# EasyEDA Pro project ProPrj_flap_controller_v2_2024-11-15.epro

# Schematic Flap_controller_r1

## Sheets
1 PSU: Board Name: Board1; Create Date: 2024-10-24; Page Name: PSU; Project Name: flap_controller_v2; Schematic Name: Flap_controller_r1; Update Date: 2024-10-27; Company: EasyEDA.com; Drawn: EasyEDA; Page Size: A4; Part Number: JLCPCB-002; Reviewed: EasyEDA; Version: V0.1
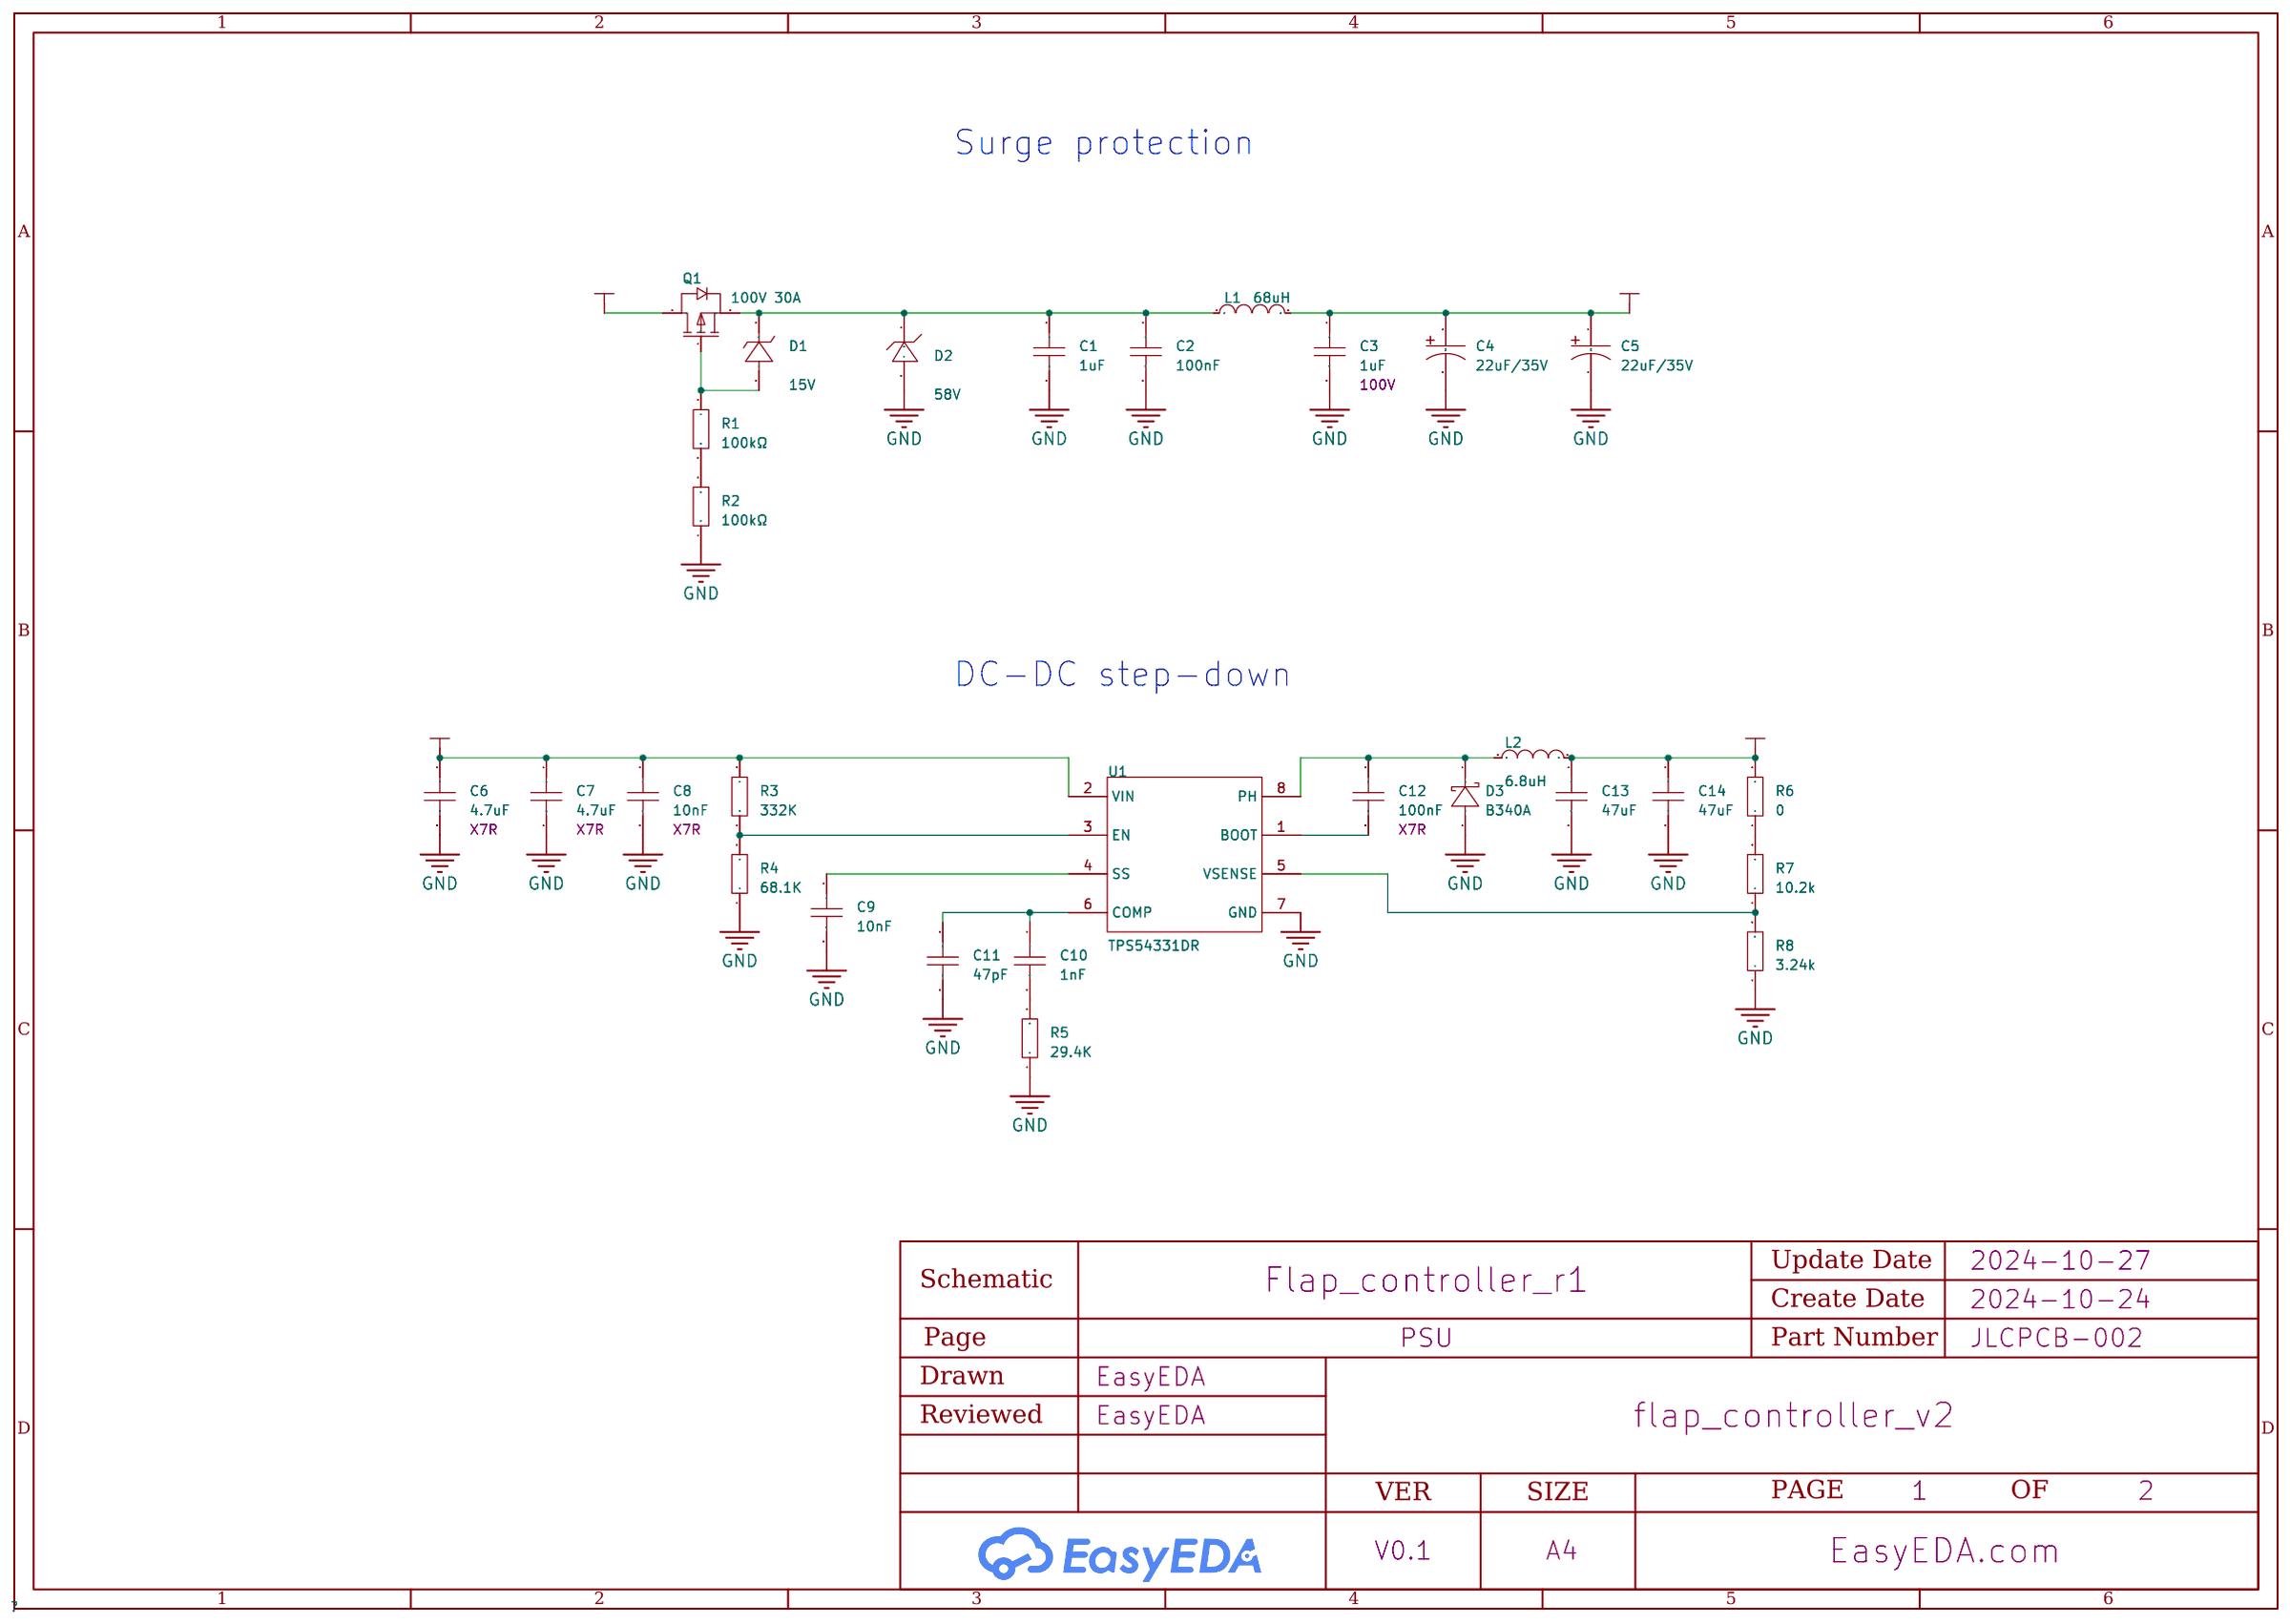
[diagram p0: PSU]
2 MCU: Create Date: 2024-10-25; Page Name: MCU; Update Date: 2024-10-30
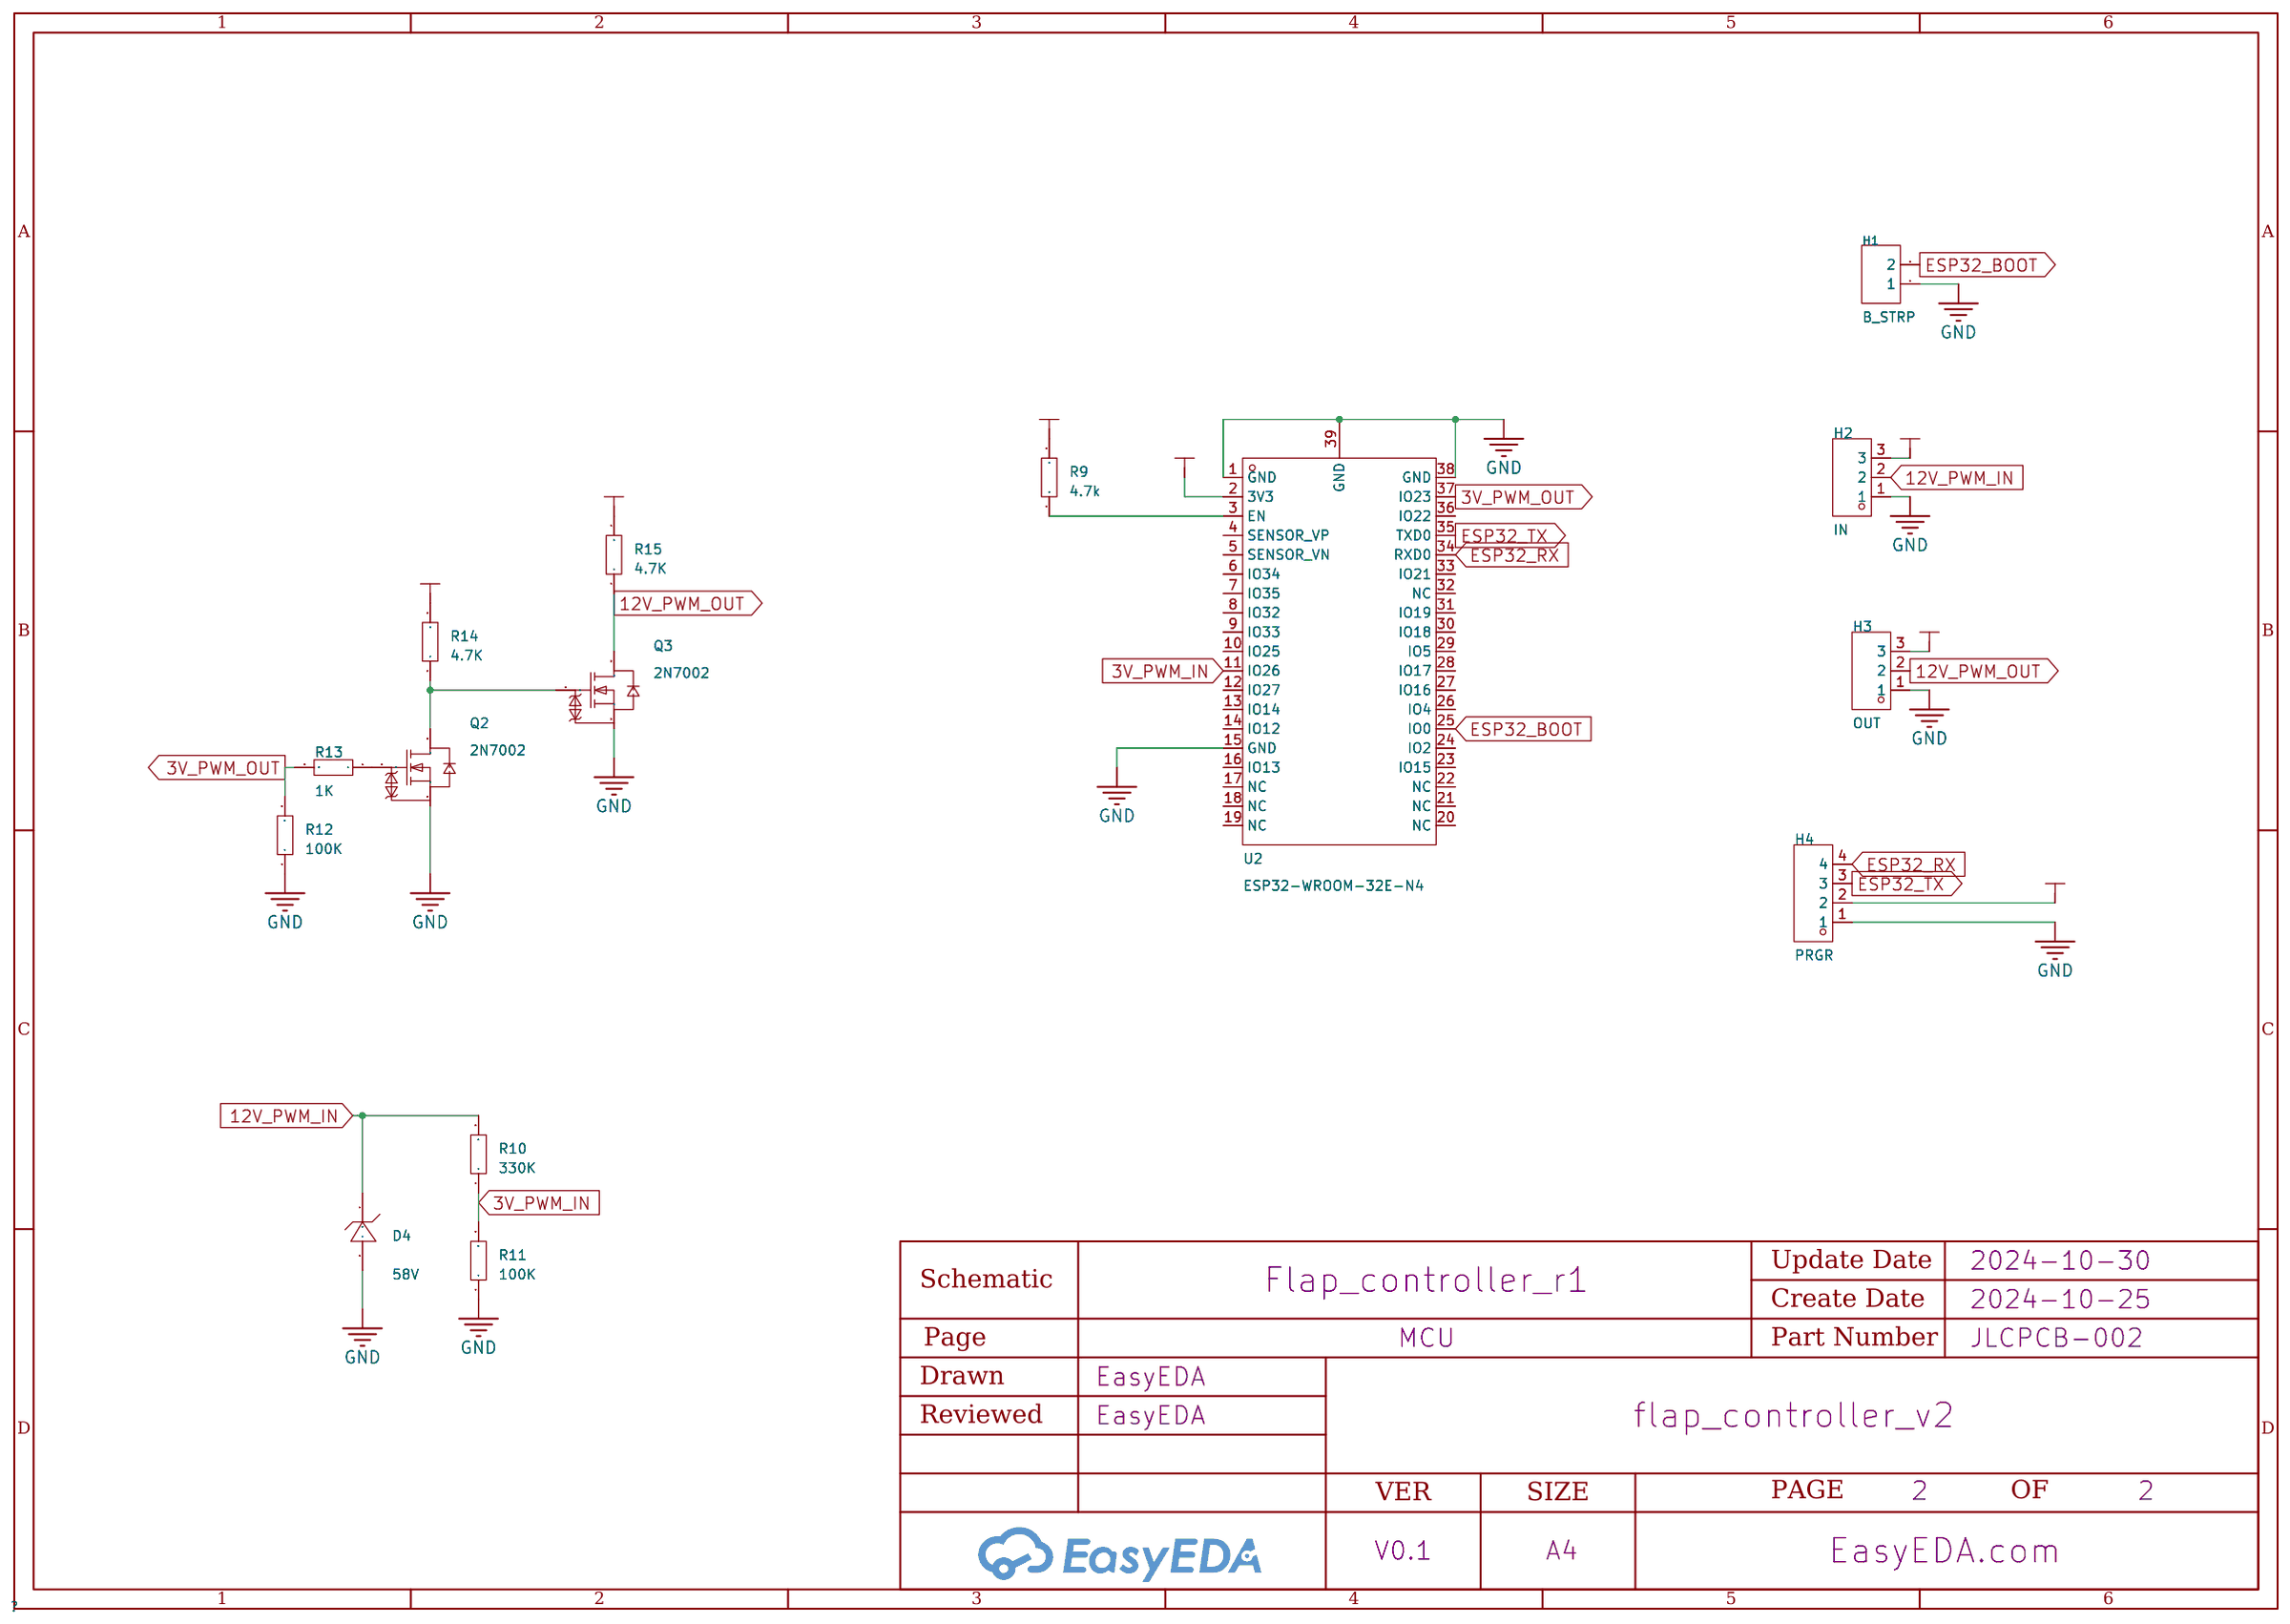
[diagram p1: MCU]

## Parts
sheet MCU
D4  58V  [SMB_L4.6-W3.6-LS5.3-RD]
H1  B_STRP  [HDR-TH_2P-P1.27-V-F-1]
H2  IN  [HDR-TH_3P-P2.54-V-F_MF254V-11-03-0743]
H3  OUT  [HDR-TH_3P-P2.54-V-F_MF254V-11-03-0743]
H4  PRGR  [HDR-TH_4P-P1.27-V-M-R2-C2-S1.27-2]
Q2  2N7002  [SOT-23-3_L2.9-W1.3-P0.95-LS2.4-BR]
Q3  2N7002  [SOT-23-3_L2.9-W1.3-P0.95-LS2.4-BR]
R9  4.7k  [R0603]
R10  330K  [R0603]
R11  100K  [R0603]
R12  100K  [R0603]
R13  1K  [R0603]
R14  4.7K  [R0603]
R15  4.7K  [R0603]
U2  ESP32-WROOM-32E-N4  [WIFI-SMD_ESP32-WROOM-32E]
sheet PSU
C1  1uF  [C0603]
C2  100nF  [C0603]
C3  1uF  [C0603]
C4  22uF/35V  [CAP-D5.0-F2.0]
C5  22uF/35V  [CAP-D5.0-F2.0]
C6  4.7uF  [C0603]
C7  4.7uF  [C0603]
C8  10nF  [C0603]
C9  10nF  [C0603]
C10  1nF  [C0603]
C11  47pF  [C0603]
C12  100nF  [C0603]
C13  47uF  [C0603]
C14  47uF  [C0603]
D1  15V  [SOD-323_L1.7-W1.3-LS2.5-RD]
D2  58V  [SMB_L4.6-W3.6-LS5.3-RD]
D3  B340A  [SMA_L4.3-W2.6-LS5.0-RD]
L1  68uH  [IND-SMD_L5.8-W5.2]
L2  6.8uH  [IND-SMD_L5.8-W5.2]
Q1  100V 30A  [TO-252-2_L6.6-W6.1-P4.57-LS10.1-BL]
R1  100kΩ  [R0603]
R2  100kΩ  [R0603]
R3  332K  [R0603]
R4  68.1K  [R0603]
R5  29.4K  [R0603]
R6  0  [R0603]
R7  10.2k  [R0603]
R8  3.24k  [R0603]
U1  TPS54331DR  [SOIC-8_L5.0-W4.0-P1.27-LS6.0-BL]

## Library data of the parts
D2 D4 = DO-214AA: Supplier Part: C9900011828; JLCPCB Part Class: Extended Part; Supplier: LCSC
H1 = B-2100S02P-A110: Pin Structure:1x2P Pitch:2.54mm Row Spacing:- Circluar Pins/Square Pins:- Mounting Type:Straight Number of Rows:Plugin Number of Pins:2P Current Rating (Max):- Voltage Rating (Max):- Length of Mating Pin:6mm Insulation Height:2.54mm Length of End Connecti; LCSC Part Name: 间距:2.54mm 1x2P 直插; Supplier Part: C124375; Manufacturer: Ckmtw(灿科盟); Supplier Footprint: 插件,P=2.54mm; JLCPCB Part Class: Extended Part; Datasheet: https://atta.szlcsc.com/upload/public/pdf/source/20221019/2EE72DAC61CAA62C0A53546E211F9C15.pdf; Supplier: LCSC; Pin Structure: 1x2P; Pitch: 2.54mm; Mounting Type: Straight; Number of Rows: Plugin; Number of Pins: 2P; Length of Mating Pin: 6mm; Insulation Height: 2.54mm; Length of End Connection Pin: 3mm; Operating Temperature Range: -40℃~+105℃; Color: Black
H2 H3 = 3pin插件排针: Supplier Part: C9900022322; Supplier Footprint: HDR-TH-3P; JLCPCB Part Class: Extended Part; Supplier: LCSC
H4 = HDR2.54-LI-2x4P: Supplier Part: C9900020145; Supplier Footprint: HDR-TH_4P-P2.54-V-M; JLCPCB Part Class: Extended Part; Supplier: LCSC
Q2 Q3 = 2N7002_C2926143: Type:1个NChannel Drain Source Voltage (Vdss): Continuous Drain Current (Id): Power Dissipation (Pd): Drain Source On Resistance (RDS(on)@Vgs,Id):7.5Ω@10V,500mA Gate Threshold Voltage (Vgs(th)@Id):2.5V@250uA Total Gate Charge (Qg@Vgs):- Input Capacitance (C; LCSC Part Name: 1个N沟道 耐压:60V 电流:115mA; Supplier Part: C2926143; Manufacturer: FOSAN(富信); Supplier Footprint: SOT-23; JLCPCB Part Class: Extended Part; Datasheet: https://atta.szlcsc.com/upload/public/pdf/source/20211203/ADA58B55D21332913BB6AE5F95CD54D7.pdf; Supplier: LCSC; Type: 1个NChannel; Drain Source On Resistance (RDS(on)@Vgs,Id): 7.5Ω@10V,500mA; Gate Threshold Voltage (Vgs(th)@Id): 2.5V@250uA; Input Capacitance (Ciss@Vds): 50pF@25V; Operating Temperature: -55℃~+150℃@(Tj)
R3-R15 = Res_0603: Supplier Footprint: 0603
U2 = ESP32-WROOM-32E-N4: LCSC Part Name: 通用型Wi-Fi+BT+BLE MCU模组; Supplier Part: C701341; Manufacturer: ESPRESSIF(乐鑫); Supplier Footprint: SMD,18x25.5mm; JLCPCB Part Class: Extended Part; Datasheet: https://atta.szlcsc.com/upload/public/pdf/source/20220601/0020821B65DE5740BBACA5FACC5CF3B6.pdf; Supplier: LCSC
C1 = C0603X105K025T: Capacitance: Tolerance:±10% Tolerance:±10% Voltage Rated: Temperature Coefficient:; LCSC Part Name: 1uF ±10% 25V; Supplier Part: C559292; Manufacturer: IHHEC(禾伸堂); Supplier Footprint: 0603; JLCPCB Part Class: Extended Part; Datasheet: https://atta.szlcsc.com/upload/public/pdf/source/20181218/C172721_07ABA3A1C2D7E9B9870089BDC15ED9B1.pdf; Supplier: LCSC; Tolerance: ±10%
C2 = C0603X104K050T: Capacitance: Tolerance:±10% Tolerance:±10% Voltage Rated: Temperature Coefficient:; LCSC Part Name: 100nF ±10% 50V; Supplier Part: C187860; Manufacturer: IHHEC(禾伸堂); Supplier Footprint: 0603; JLCPCB Part Class: Extended Part; Datasheet: https://atta.szlcsc.com/upload/public/pdf/source/20180316/B1A881EE882D7AA2911761F448C7BFE2.pdf; Supplier: LCSC; Tolerance: ±10%
C3 = CAP_0603: Supplier Footprint: 1206; Voltage: 100V
C4 C5 = 22uF/35V: Supplier Part: C9900004917; Supplier Footprint: CAP-SMD_BD5.0-L5.3-W5.3-LS6.0; JLCPCB Part Class: Extended Part; Supplier: LCSC
C6 C7 C12 = CAP_0603: X7R; Supplier Footprint: 0603
C8 = CAP_0603: Supplier Footprint: X7R
C9-C11 C13 C14 = CAP_0603: Supplier Footprint: 0603
D1 = SOD-323_C9900016724: LCSC Part Name: SOD-323; Supplier Part: C9900016724; Manufacturer Part: SOD-323; Supplier Footprint: SMD-2P; JLCPCB Part Class: Extended Part; Supplier: LCSC
D3 = B340A_C3018525: Forward Voltage (Vf@If):550mV@3A Reverse Voltage (Vr):40V Average Rectified Current (Io):3A Reverse Leakage Current (Ir):500uA@40V; LCSC Part Name: 电压:40V 电流:3A; Supplier Part: C3018525; Manufacturer: FUXINSEMI(富芯森美); Supplier Footprint: SMA(DO-214AC); JLCPCB Part Class: Extended Part; Datasheet: https://atta.szlcsc.com/upload/public/pdf/source/20220530/48889337C27311960E6F9D350CFD44EF.pdf; Supplier: LCSC; Forward Voltage (Vf@If): 550mV@3A; Reverse Voltage (Vr): 40V; Average Rectified Current (Io): 3A; Reverse Leakage Current (Ir): 500uA@40V
L1 = CY54-68UH: Inductance: Tolerance:±10% Tolerance:±10% Rated Current: Saturation Current (Isat):- DC Resistance (DCR): Q @ Freq:- Frequency - Self Resonant:- Ratings:; LCSC Part Name: 68uH ±10%; Supplier Part: C2929435; Manufacturer: SHOU HAN(首韩); Supplier Footprint: SMD,5.8x5.2mm; JLCPCB Part Class: Extended Part; Datasheet: https://atta.szlcsc.com/upload/public/pdf/source/20211213/2CA85409B3B1311983E9E122C3568FF5.pdf; Supplier: LCSC; Tolerance: ±10%
L2 = CY43-6.8UH: Inductance: Tolerance:±20% Tolerance:±20% Rated Current: Saturation Current (Isat):- DC Resistance (DCR): Q @ Freq:- Frequency - Self Resonant:- Ratings:; LCSC Part Name: 6.8uH ±20%; Supplier Part: C2929418; Manufacturer: SHOU HAN(首韩); Supplier Footprint: SMD,4.5x4mm; JLCPCB Part Class: Extended Part; Datasheet: https://atta.szlcsc.com/upload/public/pdf/source/20211213/F55B86B0868B9AEBF7E59DA1CDBCEB7E.pdf; Supplier: LCSC; Tolerance: ±20%
Q1 = AP30P10D: Type:1个PChannel Drain Source Voltage (Vdss): Continuous Drain Current (Id): Power Dissipation (Pd): Drain Source On Resistance (RDS(on)@Vgs,Id):78mΩ@10V,10A Gate Threshold Voltage (Vgs(th)@Id):1.7V@250uA Total Gate Charge (Qg@Vgs):44.5nC@10V Input Capacit; LCSC Part Name: 1个P沟道 耐压:100V 电流:30A; Supplier Part: C3011470; Manufacturer: APM(永源微电子); Supplier Footprint: TO-252-3L; JLCPCB Part Class: Extended Part; Datasheet: https://atta.szlcsc.com/upload/public/pdf/source/20220507/245812471C0427AA2FCAA6F221AD1110.pdf; Supplier: LCSC; Type: 1个PChannel; Drain Source On Resistance (RDS(on)@Vgs,Id): 78mΩ@10V,10A; Gate Threshold Voltage (Vgs(th)@Id): 1.7V@250uA; Total Gate Charge (Qg@Vgs): 44.5nC@10V; Input Capacitance (Ciss@Vds): 3.029nF@20V; Reverse Transfer Capacitance (Crss@Vds): 76pF@20V; Operating Temperature: -55℃~+150℃@(Tj)
R1 R2 = SCR0603F100K: Type:Thick Film Resistors Resistance: Tolerance:±1% Tolerance:±1% Power(Watts): Overload Voltage (Max): Operating Temperature Range:-55℃~+155℃ Operating Temperature Range:-55℃~+155℃; LCSC Part Name: 厚膜电阻 100kΩ ±1% 100mW; Supplier Part: C3016388; Manufacturer: VO(翔胜); Supplier Footprint: 0603; JLCPCB Part Class: Extended Part; Datasheet: https://atta.szlcsc.com/upload/public/pdf/source/20220513/247AF9639BA21CF93567DC289CCC6A22.pdf; Supplier: LCSC; Type: Thick Film Resistors; Tolerance: ±1%; Operating Temperature Range: -55℃~+155℃
U1 = TPS54331DR: Function:Step-down type Output Type:Adjustable Input Voltage:3.5V~28V Input Voltage:3.5V~28V Output Voltage:800mV~25V Output Voltage:800mV~25V Output Current:3A Switching Frequency:570kHz Switching Frequency:570kHz Operating Temperature:-40℃~+150℃@(TJ) Op; LCSC Part Name: 具有 Eco-mode 的 3.5V 至 28V 输入、3A、570kHz 降压转换器; Supplier Part: C9865; Manufacturer: TI(德州仪器); Supplier Footprint: SOIC-8; JLCPCB Part Class: Extended Part; Datasheet: https://www.ti.com/cn/lit/gpn/tps54331; Supplier: LCSC; Function: Step-down type; Output Type: Adjustable; Input Voltage: 3.5V~28V; Output Voltage: 800mV~25V; Output Current: 3A; Switching Frequency: 570kHz; Operating Temperature: -40℃~+150℃@(TJ); Synchronous Rectification: No; Number of Outputs: 1; Topology: Step-down; Switch tube (built-in/external): Built-in

## Nets
3V3: C13.1 C14.1 H4.2 L2.2 R6.2 R9.2 U2.2(3V3)
3V_PWM_IN: R10.1 R11.2 U2.11(IO26)
3V_PWM_OUT: R12.2 R13.2 U2.37(IO23)
12V: H2.3 H3.3 Q1.3(D)
12V_PWM_IN: D4.1(C) H2.2 R10.2
12V_PWM_OUT: H3.2 Q3.3(D) R15.1
12V_S: C3.1 C4.1 C5.1 C6.1 C7.1 C8.1 L1.2 R3.2 R14.2 R15.2 U1.2(VIN)
GND: C1.2 C2.2 C3.2 C4.2 C5.2 C6.2 C7.2 C8.2 C9.2 C11.2 C13.2 C14.2 D2.2(A) D3.2(A) D4.2(A) H1.1 H2.1 H3.1 H4.1 Q2.2(S) Q3.2(S) R2.1 R4.1 R5.1 R8.1 R11.1 R12.1 U1.7(GND) U2.1(GND) U2.15(GND) U2.38(GND) U2.39(GND)
ESP32_BOOT: H1.2 U2.25(IO0)
ESP32_RX: H4.4 U2.34(RXD0)
ESP32_TX: H4.3 U2.35(TXD0)
$1N321: D1.2(A) Q1.1(G) R1.1
$1N371: R1.2 R2.2
$1N439: C1.1 C2.1 D1.1(K) D2.1(C) L1.1 Q1.2(S)
$1N2069: R3.1 R4.2 U1.3(EN)
$1N2212: C9.1 U1.4(SS)
$1N2518: C10.2 R5.2
$1N2546: C10.1 C11.1 U1.6(COMP)
$1N2674: C12.2 U1.1(BOOT)
$1N2678: C12.1 D3.1(K) L2.1 U1.8(PH)
$1N2919: R6.1 R7.2
$1N2993: R7.1 R8.2 U1.5(VSENSE)
$2N793: Q2.1(G) R13.1
$2N870: Q2.3(D) Q3.1(G) R14.1
$2N5140: R9.1 U2.3(EN)

Not connected (* = marked no-connect by the designer): U2 4(SENSOR_VP) 5(SENSOR_VN) 6(IO34) 7(IO35) 8(IO32) 9(IO33) 10(IO25) 12(IO27) 13(IO14) 14(IO12) 16(IO13) 17(NC) 18(NC) 19(NC) 20(NC) 21(NC) 22(NC) 23(IO15) 24(IO2) 26(IO4) 27(IO16) 28(IO17) 29(IO5) 30(IO18) 31(IO19) 32(NC) 33(IO21) 36(IO22)

## Notes on the sheets
sheet 1
- Surge protection
- DC-DC step-down

# Board r1
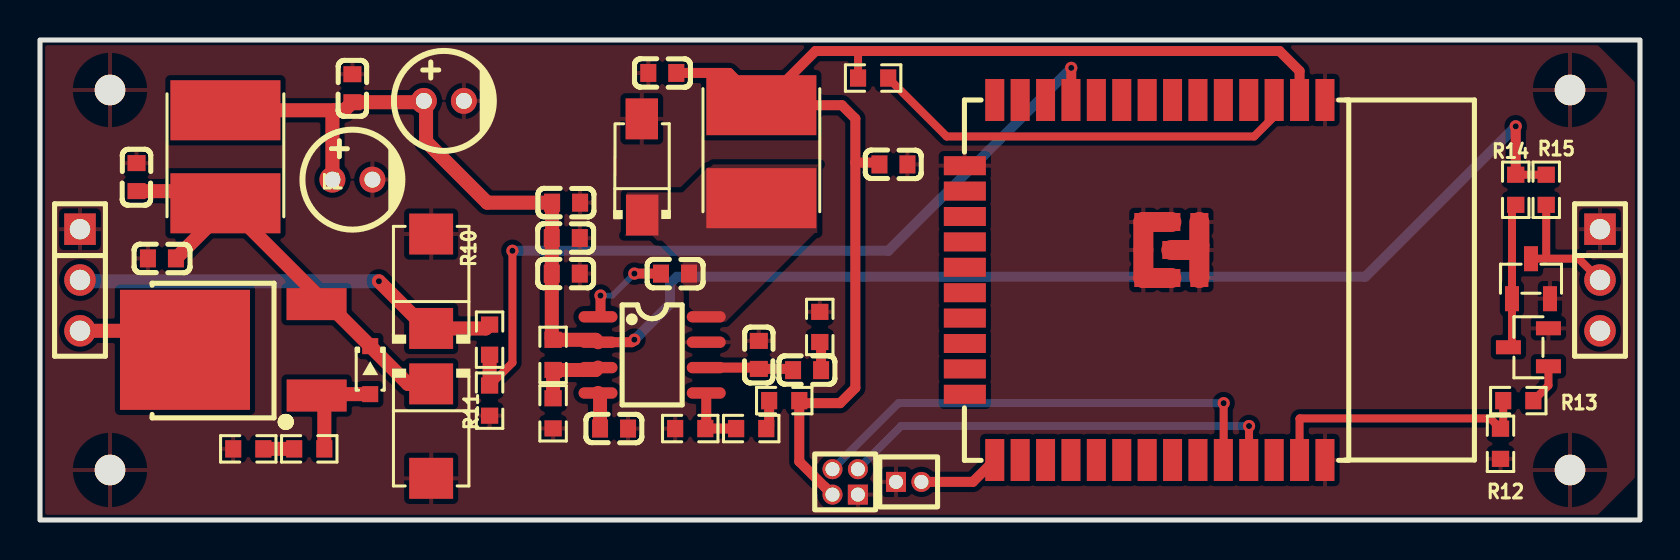
[diagram p2: board, top side]
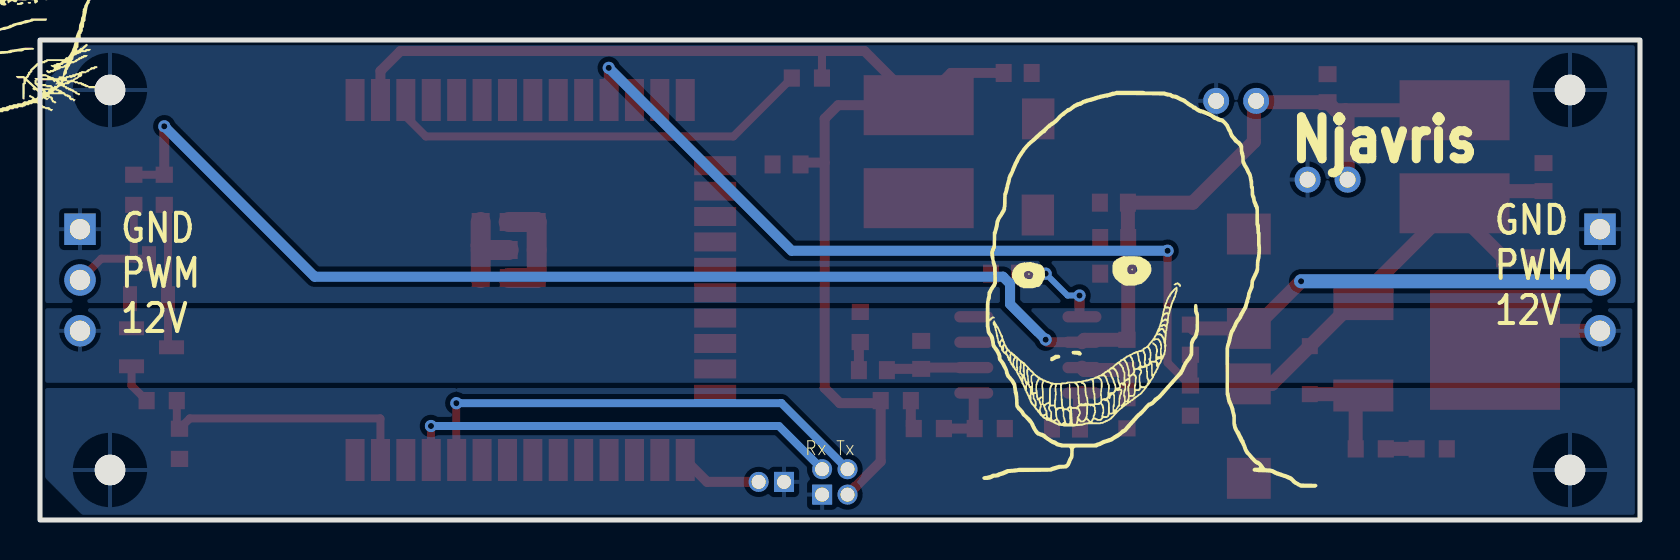
[diagram p3: board, bottom side, seen from below]

Outline 80 x 24 mm; copper layers: Top Layer, Bottom Layer. Coordinates in mm from the lower left corner of the outline.
Outline path: rectangle 0,24 80,0
Stack: Top Layer 0.035mm / Dielectric1 1.51mm FR4 er 4.5 / Bottom Layer 0.035mm

## Design rules (mm)
template: JLCPCB Capability(Two Layers Board)
spacing copperThickness1oz (default): track to track 0.102, other pairs 0.152 to 0.3
spacing copperThickness2oz: track to track 0.203, other pairs 0.152 to 0.3
track width copperThickness1oz (default): min 0.127, default 0.254, max 2.54
track width copperThickness2oz: min 0.203, default 0.254, max 2.54
differential pair differentialPair (default): width min 0.127, default 0.254, max 2.54; gap min 0.152, default 0.152
via viaSize (default): diameter min 0.5, default 0.61, max 10; hole min 0.3, default 0.305, max 6.3

## Placement (name value [footprint] x y rotation side)
C1  1uF  [C0603]  4.83 17.14 90 top
C2  100nF  [C0603]  6.1 13.08 180 top
C3  1uF  [C0603]  15.62 21.59 90 top
C4  22uF/35V  [CAP-D5.0-F2.0]  15.62 17.02 0 top
C5  22uF/35V  [CAP-D5.0-F2.0]  20.19 20.95 0 top
C6  4.7uF  [C0603]  26.3 15.87 0 top
C7  4.7uF  [C0603]  26.29 14.1 0 top
C8  10nF  [C0603]  26.29 12.32 0 top
C9  10nF  [C0603]  28.7 4.57 0 top
C10  1nF  [C0603]  38.35 7.49 0 top
C11  47pF  [C0603]  35.94 8.25 90 top
C12  100nF  [C0603]  31.75 12.32 180 top
C13  47uF  [C0603]  42.67 17.78 0 top
C14  47uF  [C0603]  31.12 22.35 180 top
D1  15V  [SOD-323_L1.7-W1.3-LS2.5-RD]  16.51 7.49 270 top
D2  58V  [SMB_L4.6-W3.6-LS5.3-RD]  19.56 4.44 270 top
D3  B340A  [SMA_L4.3-W2.6-LS5.0-RD]  30.1 17.65 90 top
D4  58V  [SMB_L4.6-W3.6-LS5.3-RD]  19.56 11.94 90 top
H1  B_STRP  [HDR-TH_2P-P1.27-V-F-1]  43.43 1.91 0 top
H2  IN  [HDR-TH_3P-P2.54-V-F_MF254V-11-03-0743]  2 12 270 top
H3  OUT  [HDR-TH_3P-P2.54-V-F_MF254V-11-03-0743]  78 12 270 top
H4  PRGR  [HDR-TH_4P-P1.27-V-M-R2-C2-S1.27-2]  40.26 1.91 90 top
L1  68uH  [IND-SMD_L5.8-W5.2]  9.27 18.16 270 top
L2  6.8uH  [IND-SMD_L5.8-W5.2]  36.07 18.42 270 top
NOREF  -  [Pad_e62]  76.5 2.5 0 top
NOREF#2  -  [Pad_e58]  3.5 21.5 0 top
NOREF#3  -  [Pad_e55]  3.5 2.5 0 top
NOREF#4  -  [Pad_e61]  76.5 21.5 0 top
Q1  100V 30A  [TO-252-2_L6.6-W6.1-P4.57-LS10.1-BL]  10.54 8.51 90 top
Q2  2N7002  [SOT-23-3_L2.9-W1.3-P0.95-LS2.4-BR]  74.42 8.64 0 top
Q3  2N7002  [SOT-23-3_L2.9-W1.3-P0.95-LS2.4-BR]  74.55 12.06 270 top
R1  100kΩ  [R0603]  13.46 3.56 180 top
R2  100kΩ  [R0603]  10.41 3.56 0 top
R3  332K  [R0603]  25.65 8.25 90 top
R4  68.1K  [R0603]  25.65 5.33 90 top
R5  29.4K  [R0603]  38.99 9.65 270 top
R6  0  [R0603]  37.21 5.97 0 top
R7  10.2k  [R0603]  35.56 4.57 0 top
R8  3.24k  [R0603]  32.51 4.57 0 top
R9  4.7k  [R0603]  41.66 22.1 180 top
R10  330K  [R0603]  22.48 9.02 90 top
R11  100K  [R0603]  22.48 5.97 90 top
R12  100K  [R0603]  73.03 3.81 90 top
R13  1K  [R0603]  73.91 5.97 180 top
R14  4.7K  [R0603]  73.79 16.51 90 top
R15  4.7K  [R0603]  75.31 16.51 90 top
U1  TPS54331DR  [SOIC-8_L5.0-W4.0-P1.27-LS6.0-BL]  30.61 8.25 270 top
U2  ESP32-WROOM-32E-N4  [WIFI-SMD_ESP32-WROOM-32E]  55.25 12 180 top

## Footprints (pads in the part's own frame, mm; a bottom-side part is the same pattern mirrored in y, then rotated)
C0603
  rect 0.8x0.9 smd: 1(-0.7,0) 2(0.7,0)
CAP-D5.0-F2.0
  round 1.3 hole 0.8: 1(-1,0) 2(1,0)
HDR-TH_2P-P1.27-V-F-1
  rect 1x1 hole 0.7: 1(-0.635,0)
  round 1 hole 0.7: 2(0.635,0)
HDR-TH_3P-P2.54-V-F_MF254V-11-03-0743
  rect 1.575x1.575 hole 1.02: 1(-2.54,0)
  round 1.575 hole 1.02: 2(0,0) 3(2.54,0)
HDR-TH_4P-P1.27-V-M-R2-C2-S1.27-2
  rect 1x1 hole 0.7: 1(-0.635,-0.635)
  round 1 hole 0.7: 2(-0.635,0.635) 3(0.635,-0.635) 4(0.635,0.635)
IND-SMD_L5.8-W5.2
  rect 3x5.5 smd: 1(2.325,0) 2(-2.325,0)
Pad_e55
  round 1.524 hole 3.2: 1(0,0)
Pad_e58
  round 1.524 hole 3.2: 1(0,0)
Pad_e61
  round 1.524 hole 3.2: 1(0,0)
Pad_e62
  round 1.524 hole 3.2: 1(0,0)
R0603
  rect 0.806x0.864 smd: 1(-0.753,0) 2(0.753,0)
SMA_L4.3-W2.6-LS5.0-RD
  rect 2.046x1.62 smd: 1(-2.404,-0.009) 2(2.404,0.009)
SMB_L4.6-W3.6-LS5.3-RD
  rect 2.047x2.192 smd: 1(-2.361,0) 2(2.361,0)
SOD-323_L1.7-W1.3-LS2.5-RD
  rect 0.8x0.8 smd: 1(-1.2,0) 2(1.2,0)
SOIC-8_L5.0-W4.0-P1.27-LS6.0-BL
  oval 0.569x1.95 smd: 1(-1.905,-2.705) 2(-0.635,-2.705) 3(0.635,-2.705) 4(1.905,-2.705) 5(1.905,2.705) 6(0.635,2.705) 7(-0.635,2.705) 8(-1.905,2.705)
SOT-23-3_L2.9-W1.3-P0.95-LS2.4-BR
  rect 1.25x0.7 smd: 1(1,-0.95) 2(1,0.95) 3(-1,0)
TO-252-2_L6.6-W6.1-P4.57-LS10.1-BL
  rect 1.6x3 smd: 1(-2.285,-3.292) 2(2.285,-3.285)
  rect 6x6.5 smd: 3(0,3.292)
WIFI-SMD_ESP32-WROOM-32E
  rect 0.95x2.1 smd: 1(-9.002,-9) 2(-7.732,-9) 3(-6.463,-9) 4(-5.192,-9) 5(-3.922,-9) 6(-2.652,-9) 7(-1.383,-9) 8(-0.113,-9) 9(1.157,-9) 10(2.428,-9) 11(3.697,-9) 12(4.968,-9) 13(6.237,-9) 14(7.508,-9) 25(7.508,9) 26(6.237,9) 27(4.968,9) 28(3.697,9) 29(2.428,9) 30(1.157,9) 31(-0.113,9) 32(-1.383,9) 33(-2.652,9) 34(-3.922,9) 35(-5.192,9) 36(-6.463,9) 37(-7.732,9) 38(-9.002,9)
  rect 2.1x0.95 smd: 15(9.002,-5.715) 16(9.002,-4.445) 17(9.002,-3.175) 18(9.002,-1.905) 19(9.002,-0.635) 20(9.002,0.635) 21(9.002,1.905) 22(9.002,3.175) 23(9.002,4.445) 24(9.002,5.715)
  rect 0.9x0.9 smd: 39(-2.721,-0.1) 39(-2.721,-1.5) 39(-2.721,-2.9) 39(-1.321,-0.1) 39(-1.321,-1.5) 39(-1.321,-2.9) 39(0.079,-0.1) 39(0.079,-1.5) 39(0.079,-2.9)

## Nets
As in the schematic, except:
GND: C1.2 C2.2 C3.2 C4.2 C5.2 C6.2 C7.2 C8.2 C9.2 C11.2 C13.2 C14.2 D2.2 D3.2 D4.2 H1.1 H2.1 H3.1 H4.1 NOREF.1 NOREF#2.1 NOREF#3.1 NOREF#4.1 Q2.2 Q3.2 R2.1 R4.1 R5.1 R8.1 R11.1 R12.1 U1.7 U2.1 U2.15 U2.38 U2.39

Pads without a net: U2 4 5 6 7 8 9 10 12 13 14 16 17 18 19 20 21 22 23 24 26 27 28 29 30 31 32 33 36

## Via types
v1: diameter 0.61, hole 0.305, Top Layer to Bottom Layer, 9 vias

## Routing (per net, layer and track width the routed paths; a pad name or vN(x,y) marks a point on that pad's centre or on a via; arc(x,y) is an arc through that point)
3V3: length 64.4
  Top Layer w0.4: R9.2 40.9,23.39 40.96,23.45
  Top Layer w0.5: C13.1 41.88,17.87 40.77,17.87 ; 40.77,17.87 40.77,20.07 40.09,20.74 L2.2 ; 40.77,17.87 40.77,6.6 40,5.84 38.09,5.84 R6.2 37.96,2.92 39.25,1.64 39.26,1.64 H4.2 ; C14.1 34.46,22.35 L2.2 ; L2.2 38.78,23.45 61.98,23.45 62.98,22.45 U2.2
3V_PWM_IN: length 42.1
  Top Layer w0.4: R11.2 23.62,7.87 v1(23.62,13.46)
  Top Layer w0.5: v1(51.56,22.61) 51.56,21.01 U2.11
  Top Layer w0.7: R10.1 R11.2
  Bottom Layer w0.5: v1(51.56,22.61) 42.42,13.46 v1(23.62,13.46)
3V_PWM_OUT: length 13.8
  Top Layer w0.4: R13.2 73.16,4.7 R12.2 72.51,5.08 62.99,5.08 62.98,5.07 U2.37
12V: length 5.6
  Top Layer w0.7: H2.3 6.3,9.46 Q1.3
12V_PWM_IN: length 21.6
  Top Layer w0.7: v1(16.95,11.94) 19.31,9.58 D4.1 22.29,9.58 R10.2
  Bottom Layer w0.7: v1(16.95,11.94) 2.06,11.94 H2.2
12V_PWM_OUT: length 6.6
  Top Layer w0.4: R15.1 75.31,13.13 75.25,13.06 ; 75.25,13.06 Q3.3 ; 75.25,13.06 76.94,13.06 H3.2
12V_S: length 87.4
  Top Layer w0.4: R15.2 R14.2
  Top Layer w0.5: v1(29.72,9.02) 29.59,8.89 U1.2 ; v1(73.79,19.69) R14.2
  Top Layer w0.7: C4.1 14.62,20.37 14.73,20.49 ; L1.2 14.73,20.49 ; 14.73,20.49 15.22,20.49 C3.1 19.13,20.89 C5.1 19.3,20.84 19.3,18.92 22.36,15.87 C6.1 25.6,14.11 C7.1 C8.1 25.59,9.07 R3.2 27.78,9.01 U1.2
  Bottom Layer w0.5: v1(29.72,9.02) 31.5,10.8 31.5,11.81 31.85,12.16 66.27,12.16 v1(73.79,19.69)
GND: length 9.9
  Top Layer w1: U2.39 57.74,13.5 57.97,13.73 ; U2.39 57.97,13.73 ; 57.97,13.73 U2.39 U2.39 ; U2.39 U2.39 U2.39 U2.39 U2.39
ESP32_BOOT: length 4.1
  Top Layer w0.5: U2.25 46.64,1.91 H1.2
ESP32_RX: length 23.8
  Top Layer w0.4: U2.34 59.18,3.01 v1(59.18,5.84)
  Bottom Layer w0.4: H4.4 42.93,5.84 v1(59.18,5.84)
ESP32_TX: length 22.2
  Top Layer w0.4: v1(60.45,4.7) 60.45,3.01 U2.35
  Bottom Layer w0.4: H4.3 43.05,4.7 v1(60.45,4.7)
$1N321: length 5.5
  Top Layer w0.7: D1.2 13.9,6.29 Q1.1 14.22,5.84 R1.1
$1N371: length 1.5
  Top Layer w0.7: R1.2 R2.2
$1N439: length 22.8
  Top Layer w0.7: C2.1 9.27,15.56 L1.1 ; D2.1 18.4,6.81 D1.1 14.41,10.79 Q1.2 13.83,11.28 L1.1 ; C1.1 8.66,16.44 L1.1
$1N2069: length 3.7
  Top Layer w0.7: U1.3 27.78,7.5 R3.1 R4.2
$1N2212: length 1.8
  Top Layer w0.7: U1.4 28,6.25 C9.1
$1N2518: length 1.4
  Top Layer w0.5: C10.2 39.05,8.83 R5.2
$1N2546: length 4.4
  Top Layer w0.5: C10.1 37.59,7.56 35.94,7.56 35.88,7.62 U1.6
$1N2674: length 4.6
  Top Layer w0.5: U1.1 28.02,10.28 v1(28.02,11.22) ; v1(29.72,12.32) C12.2
  Bottom Layer w0.3: v1(29.72,12.32) 28.62,11.22 v1(28.02,11.22)
$1N2919: length 1.5
  Top Layer w0.5: R7.2 36.46,4.72 R6.1
$1N2993: length 3.3
  Top Layer w0.5: R7.1 R8.2 33.31,4.62 U1.5
$2N793: length 2
  Top Layer w0.4: Q2.1 75.42,6.72 R13.1
$2N870: length 7.3
  Top Layer w0.4: R14.1 73.6,15.57 Q3.1 73.6,8.81 Q2.3
$2N5140: length 21.7
  Top Layer w0.4: U2.3 61.71,20.18 60.71,19.18 45.33,19.18 R9.1

## Copper pours and planes (outline as drawn; the poured copper is in the pictures)
12V on Bottom Layer: 0.38,10.59 80,10.59 80,6.86 0.38,6.86
GND on Top Layer: 0,24 80,24 80,0 0,0
GND on Bottom Layer: 0,24 80,24 80,0 0,0
$1N2678 on Top Layer: 29.21,17.78 38.99,17.78 38.99,9.91 29.21,9.91

## Text on the board
Bottom Silkscreen Layer: Rx Tx | GND / PWM / 12V | Njavris
